# EasyEDA Pro project PCB.eprj, board PCB
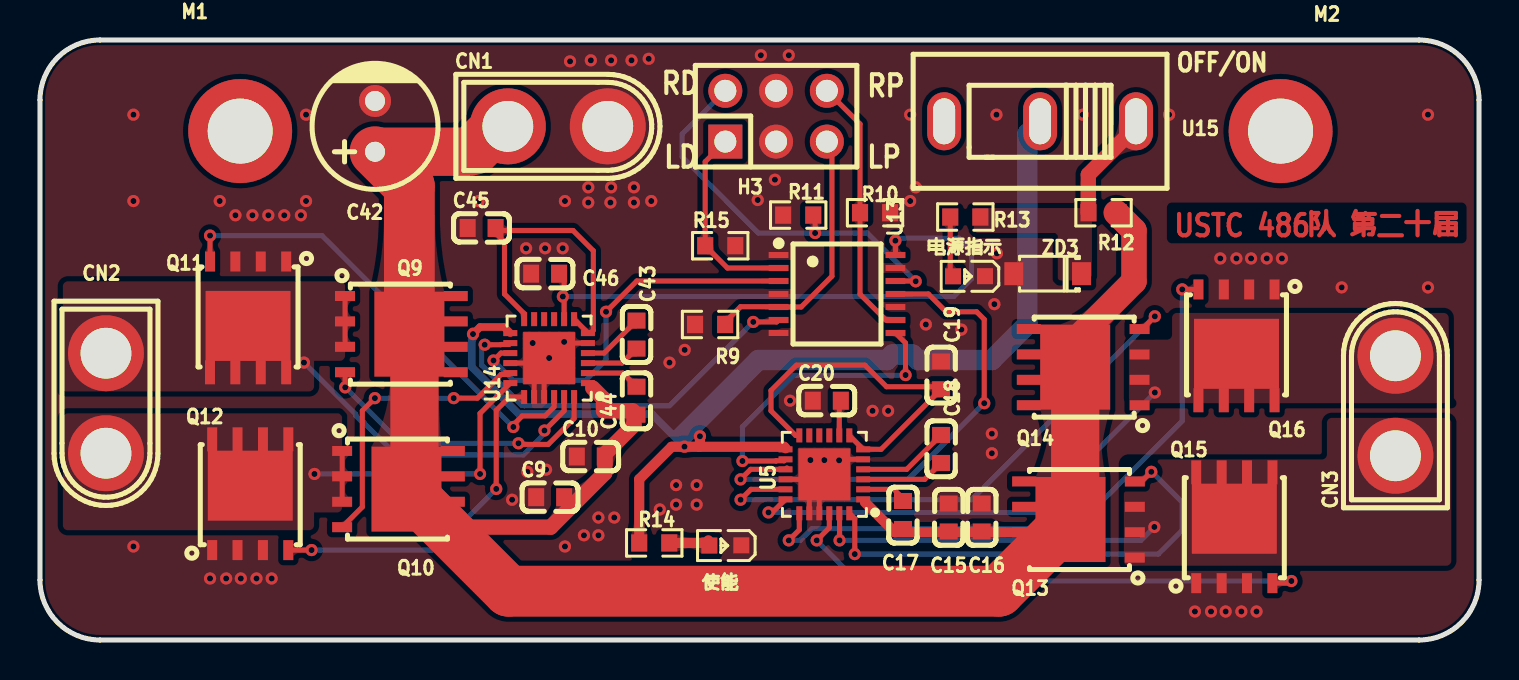
[diagram p7: board, top side]
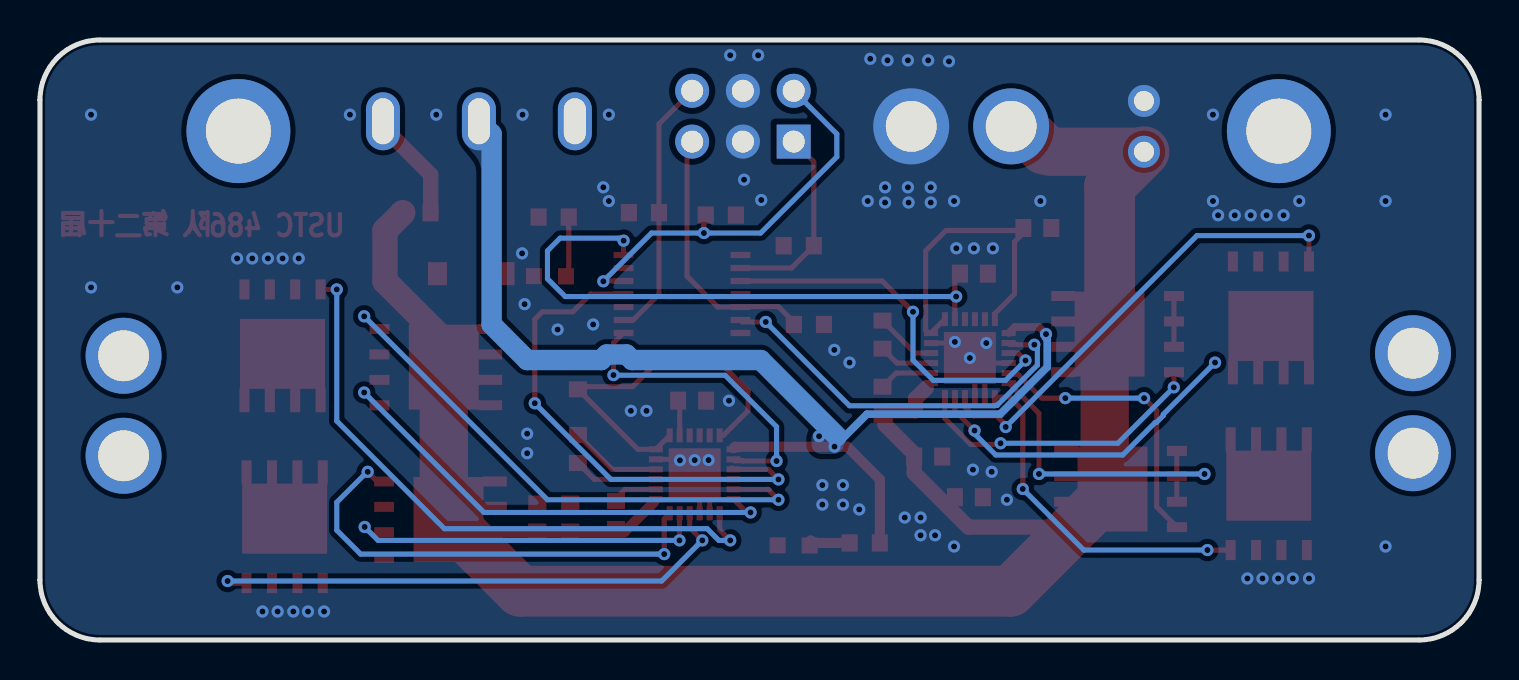
[diagram p8: board, bottom side, seen from below]

Outline 72 x 30 mm; copper layers: Top Layer, Bottom Layer. Coordinates in mm from the lower left corner of the outline.
Outline path: 0,27 0,3 arc(0.88,0.88) 3,0 69,0 arc(71.12,0.88) 72,3 72,27 arc(71.12,29.12) 69,30 3,30 arc(0.88,29.12) 0,27
Stack: Top Layer 0.035mm / Dielectric1 1.51mm FR4 er 4.5 / Bottom Layer 0.035mm

## Design rules (mm)
template: 自定义配置
spacing copperThickness1oz (default): track to track 0.102, other pairs 0.152 to 0.3
spacing copperThickness2oz: track to track 0.203, other pairs 0.152 to 0.3
track width copperThickness1oz (default): min 0.127, default 0.254, max 2.54
track width copperThickness2oz: min 0.203, default 0.254, max 2.54
differential pair differentialPair (default): width min 0.127, default 0.254, max 2.54; gap min 0.152, default 0.152
via viaSize (default): diameter min 0.5, default 0.61, max 10; hole min 0.3, default 0.305, max 6.3
net VM uses 直连焊盘
net GND uses 直连焊盘
net SH2 uses 直连焊盘
net SH1 uses 直连焊盘
net SH22 uses 直连焊盘
net SH12 uses 直连焊盘
net 3.3V uses 直连焊盘

## Placement (name value [footprint] x y rotation side)
C9  10uF  [C0603]  25.53 7.14 0 top
C10  100nF  [C0603]  27.56 9.17 0 top
C15  10uF  [C0603]  45.47 6.12 270 top
C16  100nF  [C0603]  47.12 6.12 270 top
C17  1uF  [C0603]  43.18 6.25 90 top
C18  100nF  [C0603]  45.08 9.55 270 top
C19  1uF  [C0603]  45.08 13.24 270 top
C20  1uF  [C0603]  39.37 11.97 0 top
C42  220uF  [CAP-TH_BD6.3-P2.50-D1.0-FD]  16.76 25.68 90 top
C43  100nF  [C0603]  29.84 15.27 270 top
C44  1uF  [C0603]  29.84 11.97 90 top
C45  1uF  [C0603]  22.1 20.6 0 top
C46  1uF  [C0603]  25.27 18.32 0 top
CN1  XT30U-M  [CONN-TH_XT30U-M]  25.91 25.68 0 top
CN2  XT30U-M  [CONN-TH_XT30U-M]  3.3 11.84 270 top
CN3  XT30U-M  [CONN-TH_XT30U-M]  67.82 11.71 90 top
H3  PZ254V-12-6P  [HDR-TH_6P-P2.54-V-M-R2-C3-S2.54]  36.83 26.19 0 top
M1  MountHole  [M3-MountHole-Plated]  10.02 25.45 0 top
M2  MountHole  [M3-MountHole-Plated]  62.07 25.45 0 top
Q9  TPH1R403NL  [DSOP-8_L5.0-W5.0-P1.27-LS6.0-BL-EP]  18.03 15.29 270 top
Q10  TPH1R403NL  [DSOP-8_L5.0-W5.0-P1.27-LS6.0-BL-EP]  17.89 7.55 270 top
Q11  TPH1R403NL  [DSOP-8_L5.0-W5.0-P1.27-LS6.0-BL-EP]  10.41 16.16 180 top
Q12  TPH1R403NL  [DSOP-8_L5.0-W5.0-P1.27-LS6.0-BL-EP]  10.52 7.27 0 top
Q13  TPH1R403NL  [DSOP-8_L5.0-W5.0-P1.27-LS6.0-BL-EP]  52.01 6.02 90 top
Q14  TPH1R403NL  [DSOP-8_L5.0-W5.0-P1.27-LS6.0-BL-EP]  52.25 13.64 90 top
Q15  TPH1R403NL  [DSOP-8_L5.0-W5.0-P1.27-LS6.0-BL-EP]  59.76 5.61 0 top
Q16  TPH1R403NL  [DSOP-8_L5.0-W5.0-P1.27-LS6.0-BL-EP]  59.87 14.76 180 top
R9  10kΩ  [R0603]  33.53 15.78 180 top
R10  10kΩ  [R0603]  41.78 21.36 180 top
R11  10kΩ  [R0603]  37.94 21.25 0 top
R12  2kΩ  [R0603]  53.21 21.36 180 top
R13  1kΩ  [R0603]  46.3 21.15 0 top
R14  330Ω  [R0603]  30.73 4.85 180 top
R15  10kΩ  [R0603]  34.04 19.71 0 top
U5  DRV8701ERGER  [VQFN-24_L4.0-W4.0-P0.50-BL-EP2.5]  39.24 8.28 90 top
U13  SN74HC125PWR  [TSSOP-14_L5.0-W4.4-P0.65-LS6.5-BL]  39.88 17.3 270 top
U14  DRV8701ERGER  [VQFN-24_L4.0-W4.0-P0.50-BL-EP2.5]  25.47 14.1 90 top
U15  SS12D10G5  [SW-TH_SHOU-HAN_SS12D10G4]  50.04 25.94 180 top
ZD3  BZT52C3V3  [SOD-123_L2.8-W1.8-LS3.7-RD]  50.42 18.32 180 top
使能  NCD0603R1  [LED0603-RD_RED]  34.29 4.73 180 top
电源指示  NCD0603R1  [LED0603-RD_RED]  46.48 18.19 180 top

## Footprints (pads in the part's own frame, mm; a bottom-side part is the same pattern mirrored in y, then rotated)
C0603
  rect 0.8x0.9 smd: 1(-0.7,0) 2(0.7,0)
CAP-TH_BD6.3-P2.50-D1.0-FD
  round 1.6 hole 1: 1(-1.27,0) 2(1.27,0)
CONN-TH_XT30U-M
  round 3.8 hole 2.54: 1(-2.5,0) 2(2.5,0)
DSOP-8_L5.0-W5.0-P1.27-LS6.0-BL-EP
  rect 0.5x1 smd: 1(-1.905,-2.77) 2(-0.635,-2.77) 3(0.634,-2.77) 4(1.905,-2.77)
  rect 0.5x1.2 smd: 5(1.905,2.77) 6(0.635,2.77) 7(-0.634,2.77) 8(-1.905,2.77)
  custom 4.25x3.5 smd: 9(0,0.45)
HDR-TH_6P-P2.54-V-M-R2-C3-S2.54
  rect 1.7x1.7 hole 1.1: 1(-2.54,-1.27)
  round 1.7 hole 1.1: 2(-2.54,1.27) 3(0,-1.27) 4(0,1.27) 5(2.54,-1.27) 6(2.54,1.27)
LED0603-RD_RED
  rect 0.8x0.8 smd: 1(-0.799,-0.004) 2(0.799,0.004)
M3-MountHole-Plated
  round 5.2 hole 3.25: 1(0,0)
R0603
  rect 0.806x0.864 smd: 1(-0.753,0) 2(0.753,0)
SOD-123_L2.8-W1.8-LS3.7-RD
  rect 0.95x1.15 smd: 1(-1.692,0) 2(1.692,0)
SW-TH_SHOU-HAN_SS12D10G4
  oval 1.7x2.9 hole 1.1x2.3: 1(-4.8,0) 2(0,0) 3(4.8,0)
TSSOP-14_L5.0-W4.4-P0.65-LS6.5-BL
  rect 0.305x0.991 smd: 1(-1.95,-2.925) 2(-1.3,-2.925) 3(-0.65,-2.925) 4(0,-2.925) 5(0.65,-2.925) 6(1.3,-2.925) 7(1.95,-2.925) 8(1.95,2.925) 9(1.3,2.925) 10(0.65,2.925) 11(0,2.925) 12(-0.65,2.925) 13(-1.3,2.925) 14(-1.95,2.925)
VQFN-24_L4.0-W4.0-P0.50-BL-EP2.5
  rect 0.3x0.7 smd: 1(-1.25,-1.942) 2(-0.75,-1.942) 3(-0.25,-1.942) 4(0.25,-1.942) 5(0.75,-1.942) 6(1.25,-1.942) 13(1.25,1.942) 14(0.75,1.942) 15(0.25,1.942) 16(-0.25,1.942) 17(-0.75,1.942) 18(-1.25,1.942)
  rect 0.7x0.3 smd: 7(1.948,-1.25) 8(1.948,-0.75) 9(1.948,-0.25) 10(1.948,0.25) 11(1.948,0.75) 12(1.948,1.25) 19(-1.948,1.25) 20(-1.948,0.75) 21(-1.948,0.25) 22(-1.948,-0.25) 23(-1.948,-0.75) 24(-1.948,-1.25)
  rect 2.6x2.6 smd: 25(0.001,-0.001)

## Nets
As in the schematic.

Pads without a net: M1 1; M2 1; U5 9 10 11; U14 9 10 11; U15 3

## Via types
v1: diameter 0.61, hole 0.305, Top Layer to Bottom Layer, 125 vias

## Routing (per net, layer and track width the routed paths; a pad name or vN(x,y) marks a point on that pad's centre or on a via; arc(x,y) is an arc through that point)
3.3V: length 5.4
  Top Layer w0.762: 54.46,25.94 54.46,25.28 52.45,23.27 52.45,21.37 R12.2
DVDD: length 29.4
  Top Layer w0.254: 26.1,18.32 26.23,18.19 26.23,16.05 ; U13.14 42.8,19.96 v1(42.8,19.97)
  Bottom Layer w0.254: v1(26.16,17.17) 45.72,17.17 46.61,18.06 46.61,19.46 45.97,20.09 42.93,20.09 v1(42.8,19.97)
GND: length 13.5
  Top Layer w0.254: 25.23,13.85 24.73,13.35 24.73,12.15 ; 25.23,13.85 U14.25 v1(25.48,14.1) 26.23,14.85 27.42,14.85 ; 25.23,13.85 23.53,13.85 ; U5.16 38.99,8.03 U5.21 ; U5.5 40.15,9.03 ; U14.21 25.22,13.79 ; U5.20 38.49,7.53
  vias: v1(4.68,26.27) v1(4.68,21.95) v1(4.68,4.68) v1(8.51,3.08) v1(8.99,21.95) v1(9.32,3.08) v1(9.78,21.24) v1(10.05,3.08) v1(10.63,21.24) v1(10.83,3.08) v1(11.43,21.24) v1(11.59,3.08) v1(12.22,21.24) v1(13.06,21.24) v1(13.31,26.27) v1(13.31,21.95) v1(21.95,21.95) v1(23.62,7.01) v1(24.32,19.59) v1(24.38,8.41) v1(24.65,14.85) v1(25.27,19.59) v1(25.32,8.52) v1(26.15,19.59) v1(26.27,21.95) v1(26.23,14.91) v1(26.27,4.68) v1(26.52,28.93) v1(27.22,5.23) v1(27.43,22.63) v1(27.43,21.87) v1(27.56,28.98) v1(27.94,6.12) v1(27.94,5.23) v1(28.58,28.98) v1(28.58,22.63) v1(28.54,21.87) v1(28.73,6.12) v1(29.6,28.98) v1(29.72,22.63) v1(29.72,21.87) v1(30.46,29.06) v1(30.58,21.95) v1(31.01,6.53) v1(31.5,13.87) v1(31.83,7.75) v1(31.83,6.77) v1(32.26,14.51) v1(32.86,7.75) v1(32.86,6.77) v1(35.91,22) v1(36.07,29.24) v1(36.77,23.02) v1(37.47,29.24) v1(37.53,11.97) v1(38.55,9) v1(39.24,8.99) v1(39.98,8.98) v1(41.66,11.46) v1(42.44,11.46) v1(43.54,26.27) v1(43.54,21.95) v1(43.81,22.63) v1(44.32,15.78) v1(46.1,15.52) v1(47.62,10.31) v1(47.62,9.34) v1(47.75,16.79) v1(47.86,26.27) v1(47.88,19.33) v1(52.17,26.27) v1(56.49,26.27) v1(57.78,1.42) v1(58.59,1.42) v1(59.05,19.08) v1(59.33,1.42) v1(59.86,19.08) v1(60.11,1.42) v1(60.59,19.08) v1(60.87,1.42) v1(61.38,19.08) v1(62.14,19.08) v1(65.13,17.63) v1(69.45,26.27) v1(69.45,17.63)
GH1: length 14.4
  Top Layer w0.254: v1(16.76,12.09) 16.13,11.47 16.13,6.66 15.12,5.64 ; v1(20.7,12.09) 21.88,12.09 23.07,13.28 23.46,13.28 23.53,13.35
  Bottom Layer w0.254: v1(20.7,12.09) v1(16.76,12.09)
GH2: length 15
  Top Layer w0.254: 15.26,13.39 15.26,12.64 v1(15.27,12.63) ; 26.73,12.15 26.73,11.08 25.43,9.78 24,9.78 v1(23.94,9.84)
  Bottom Layer w0.254: v1(15.27,12.63) 18.07,9.84 v1(23.94,9.84)
GH12: length 28
  Top Layer w0.254: U5.17 35.57,7.53 v1(35.05,7.01) ; v1(55.78,16.18) 55.14,15.55 Q14.4
  Bottom Layer w0.254: v1(35.05,7.01) 46.61,7.01 v1(55.78,16.18)
GH22: length 23.6
  Top Layer w0.254: v1(40.77,4.3) 40.77,6.06 U5.24 ; 54.78,7.93 55.12,7.93 v1(55.6,8.41)
  Bottom Layer w0.254: v1(40.77,4.3) 55.96,4.3 57.15,5.49 57.15,6.89 55.63,8.41 v1(55.6,8.41)
GL1: length 17.3
  Top Layer w0.254: 24.23,12.15 23.49,12.15 22.83,11.48 v1(22.83,7.55) ; Q12.4 13.59,4.5 v1(13.59,4.5)
  Bottom Layer w0.254: v1(22.83,7.55) 19.77,4.5 v1(13.59,4.5)
GL2: length 23.3
  Top Layer w0.254: U14.22 25.72,11.65 25.27,11.2 24.13,11.2 23.68,10.76 v1(23.68,10.65) ; 8.51,19.05 v1(8.51,20.22)
  Bottom Layer w0.254: v1(8.51,20.22) 14.11,20.22 v1(23.68,10.65)
GL12: length 31.1
  Top Layer w0.254: U5.19 37.99,5.51 v1(37.46,4.98) ; Q16.4 57.96,17.53 v1(57.15,17.53)
  Bottom Layer w0.254: v1(57.15,17.53) 57.15,10.95 51.77,5.56 38.62,5.56 38.04,4.98 v1(37.46,4.98)
GL22: length 27.2
  Top Layer w0.254: Q15.4 62.51,2.84 v1(62.61,2.95) ; v1(38.86,4.98) 39.49,5.61 U5.22
  Bottom Layer w0.254: v1(38.86,4.98) 40.89,2.95 v1(62.61,2.95)
L_DIR_IN: length 9.8
  Top Layer w0.254: H3.1 33.28,23.91 R15.1 34.4,18.6 U13.2
L_EN: length 19.9
  Top Layer w0.254: v1(22.25,14.76) 23.05,14.76 23.07,14.78 23.46,14.78 23.53,14.85 ; U13.6 36.86,15.9 v1(35.69,15.9)
  Bottom Layer w0.254: v1(22.25,14.76) 22.1,14.61 22.1,13.74 24.11,11.73 24.21,11.73 24.23,11.71 31.5,11.71 v1(35.69,15.9)
L_PH: length 19.1
  Top Layer w0.254: v1(22.69,13.98) 23.06,14.35 23.53,14.35 ; v1(28.32,16.41) 29.86,17.95 U13.3
  Bottom Layer w0.254: v1(28.32,16.41) 28.32,14 27.3,12.98 23.69,12.98 v1(22.69,13.98)
L_PWM_IN: length 13.3
  Top Layer w0.254: H3.5 39.62,24.67 39.62,18.19 38.08,16.65 U13.5 36.94,16.67 35.05,16.67 34.16,15.78 34.15,15.78
NSLEEP: length 58.2
  Top Layer w0.381: U14.13 23.23,15.65 22.02,15.65 v1(21.67,15.3)
  Top Layer w0.508: 32.98,9.66 31.6,9.66 29.98,8.04 R14.2 ; 32.98,9.66 33.02,9.7 v1(33.02,10.19) ; 32.98,9.66 37.23,9.66 37.3,9.59 ; v1(21.67,15.3) 21.67,15.37
  Bottom Layer w0.381: v1(21.67,15.3) 21.67,15.1 21.6,15.03 21.6,13.65 23.96,11.29 30.62,11.29 v1(32.25,9.67)
  Bottom Layer w1.016: 32.13,10.19 35.94,14 42.38,14 42.65,14.28 43.64,14.28 43.92,14 47.62,14 49.4,15.78 49.4,25.3 U15.2
R_DIR_IN: length 20.4
  Top Layer w0.254: U13.12 43.8,17.95 v1(43.81,17.94) ; v1(38.78,20.35) 38.78,21.18 38.73,21.24
  Bottom Layer w0.254: v1(43.81,17.94) 41.4,20.35 v1(38.78,20.35) 35.94,20.35 32.13,24.16 32.13,25.3 H3.2
R_EN: length 15.4
  Top Layer w0.254: v1(43.31,13.25) 43.31,14.85 U13.8 ; U5.14 37.23,8.96 36.84,8.96 36.82,8.95 v1(35.15,8.95)
  Bottom Layer w0.254: v1(35.15,8.95) 35.15,10.66 37.72,13.24 43.3,13.24 v1(43.31,13.25)
R_PH: length 25.5
  Top Layer w0.254: v1(35.05,8.03) 35.56,8.53 U5.15 37.37,8.6 ; v1(47.24,11.84) 47.24,16.03 46.86,16.41 45.34,16.41 44.45,17.3 U13.11
  Bottom Layer w0.254: v1(35.05,8.03) 43.43,8.03 v1(47.24,11.84)
R_PWM_IN: length 13.2
  Top Layer w0.254: U13.9 42.32,16 41.03,17.29 R10.2 41.03,25.8 H3.6
SH1: length 16
  Top Layer w0.254: 15.12,6.92 15.12,9.45 ; v1(22.02,8.3) 22.02,11.33 23.53,12.85
  Bottom Layer w0.254: v1(22.02,8.3) v1(13.73,8.3)
SH2: length 19.2
  Top Layer w0.254: 15.26,17.2 15.26,14.66 ; 26.23,12.15 26.23,11.46 v1(25.24,10.47)
  Bottom Layer w0.254: v1(25.24,10.47) 25.24,10.31 24.18,9.25 17.83,9.25 16.2,10.87 16.14,10.87 15.8,11.22 15.8,11.28 v1(13.21,13.87)
SH12: length 22.9
  Top Layer w0.254: v1(36.45,6.38) 36.65,6.38 U5.18
  Bottom Layer w0.254: v1(36.45,6.38) 49.78,6.38 v1(55.78,12.37)
SH22: length 17.4
  Top Layer w0.254: v1(40,4.98) 40,6.32 U5.23
  Bottom Layer w0.254: v1(40,4.98) 55.08,4.98 v1(55.75,5.65)
VM: length 101.8
  Top Layer w0.508: 41.27,6.89 42.77,5.39 Q13.7
  Top Layer w0.762: 20.66,5.64 25.55,5.64 28.26,8.35 28.26,9.3 29.72,10.76 29.72,11.39 29.65,11.46 28.19,11.46 28.19,12.06 27.65,12.6
  Top Layer w1.27: 53.85,21.36 54.74,20.47 54.74,17.94 51.92,15.12 51.92,13.77
  Top Layer w2.413: Q14.9 51.8,6.26 51.56,6.02 ; 21.46,24.41 C42.1 ; Q10.9 18.59,7.55 18.74,7.69 18.74,15.04 Q9.9
  Top Layer w2.54: Q10.9 23.44,2.44 47.98,2.44 51.56,6.02 ; C42.1 18.48,22.69 Q9.9 ; 21.76,24.54 22.9,25.68
$3N18428: length 3
  Top Layer w0.254: 45.63,18.19 45.54,18.28 R13.1
$3N18460: length 2
  Top Layer w0.508: R14.1 33.31,4.85 33.44,4.98
$3N18468: length 1.9
  Top Layer w0.254: 39.94,12.09 39.99,12.04 U5.8
$3N18476: length 18.9
  Top Layer w0.254: U5.12 37.8,10.23 36.58,11.46 36.58,12.47 37.85,13.74 41.27,13.74 42.36,12.66 45.21,12.66 42.08,9.53 U5.6 41.18,9.54 U5.7
$3N18483: length 2.4
  Top Layer w0.254: 43.31,6.95 42.73,7.53 U5.2
$3N18484: length 4.2
  Top Layer w0.254: C18.2 44.27,8.03 U5.3
$3N18485: length 4.6
  Top Layer w0.254: U5.4 43.36,8.53 C18.1
$3N18498: length 15.8
  Top Layer w0.254: 26.73,16.05 27.42,15.35 27.42,15.35 27.54,15.35 27.69,15.49 27.69,19.46 26.67,20.47 22.67,20.47 23.24,19.91 23.24,17.3 24.23,16.32 24.23,16.05
$3N18502: length 2.7
  Top Layer w0.254: U14.2 29.17,13.35 C44.2
$3N18503: length 3.1
  Top Layer w0.254: C43.1 28.22,14.35 U14.4
$3N18505: length 2.7
  Top Layer w0.254: C43.2 29.12,13.85 U14.3

## Copper pours and planes (outline as drawn; the poured copper is in the pictures)
3.3V on Top Layer: 46.72,21.6 52.64,21.6 52.64,18.19 52.42,17.98 51.01,17.98 50.93,18.06 50.93,20.22 50.8,20.35 46.86,20.35 46.72,20.49
GND on Top Layer: -4.32,35.97 75.31,35.97 75.31,-4.42 -4.32,-4.42
GND on Bottom Layer: -6.22,40.41 78.99,40.41 78.99,-6.45 -6.22,-6.45
NSLEEP on Bottom Layer: 31.78,10.06 31.8,10.17 31.85,10.3 31.93,10.42 32.05,10.51 32.18,10.56 32.29,10.57 32.89,10.57 33,10.56 33.14,10.51 33.25,10.42 33.34,10.3 33.39,10.17 33.4,10.06 33.4,9.81 33.39,9.7 33.34,9.56 33.25,9.45 33.14,9.36 33,9.31 32.89,9.3 32.29,9.3 32.18,9.31 32.05,9.36 31.93,9.45 31.85,9.56 31.8,9.7 31.78,9.81
SH1 on Top Layer: 14.86,6.38 15.04,6.45 15.11,6.63 15.11,11.19 14.97,11.33 1.4,11.33 1.22,11.26 1.14,11.08 1.14,5.74 1.22,5.56 1.4,5.49 13.46,5.49 13.64,5.56 13.72,5.74 13.72,6.38 13.72,6.38
SH2 on Top Layer: 1.14,17.68 1.22,17.86 1.4,17.94 15.01,17.94 15.19,17.86 15.26,17.68 15.26,14.21 15.19,14.03 15.01,13.96 13.72,13.96 13.72,12.69 13.64,12.51 13.46,12.43 1.23,12.43 1.14,12.43
SH12 on Top Layer: 54.74,11.84 54.56,11.91 54.48,12.09 54.48,14.76 54.56,14.94 54.74,15.01 55.14,15.01 55.14,15.02 56.39,15.02 56.57,15.09 56.64,15.27 56.64,16.1 56.72,16.28 56.9,16.35 70.23,16.35 70.41,16.28 70.48,16.1 70.48,11.97 70.61,11.84
SH22 on Top Layer: 54.97,3.72 70.36,3.72 70.54,3.79 70.61,3.97 70.61,10.85 70.54,11.03 70.36,11.11 64.64,11.11 64.46,11.03 64.39,10.85 64.39,9.28 64.31,9.1 64.14,9.03 54.48,9.03 54.3,8.95 54.23,8.77 54.23,3.97 54.3,3.79 54.48,3.71 54.96,3.71

Small or netless copper shapes (teardrops, artwork), in the pictures only: 127 on Top Layer, 32 on Bottom Layer

## Text on the board
Top Layer: USTC 486队 第二十届
Top Solder Mask Layer: USTC 486队 第二十届
Top Silkscreen Layer: OFF/ON | RD | LD | RP | LP
